# Altium schematic sheet Page06 CPU IO.SchDoc
size 513 x 386 mm; SheetNumber: 6; SheetTotal: 13
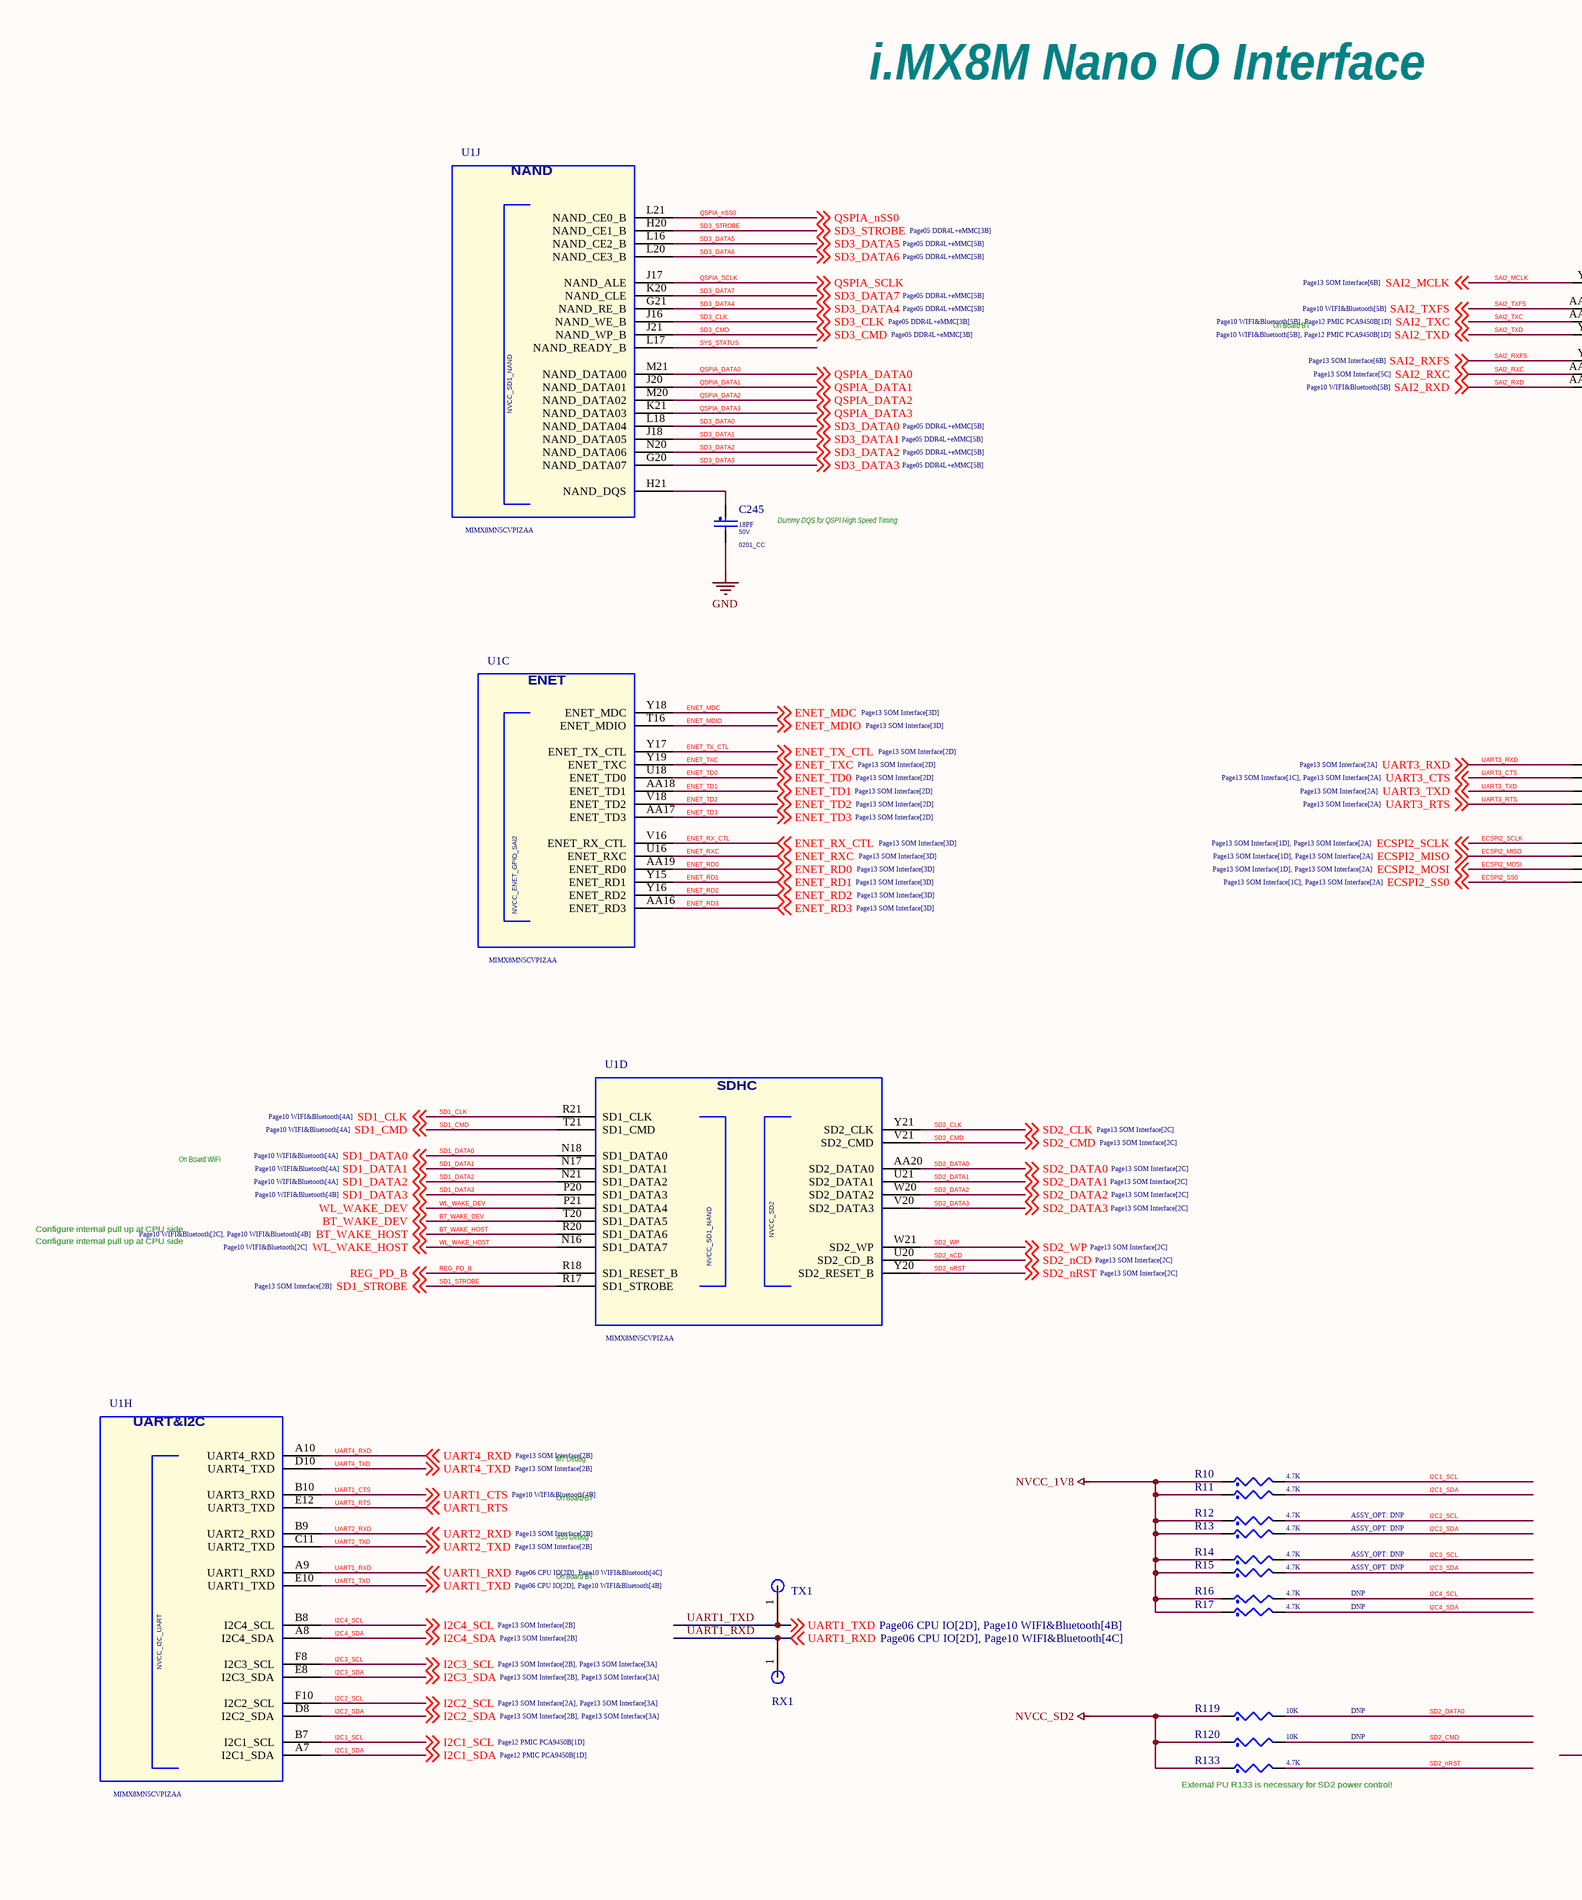
[diagram p0: Page06 CPU IO.SchDoc, left]
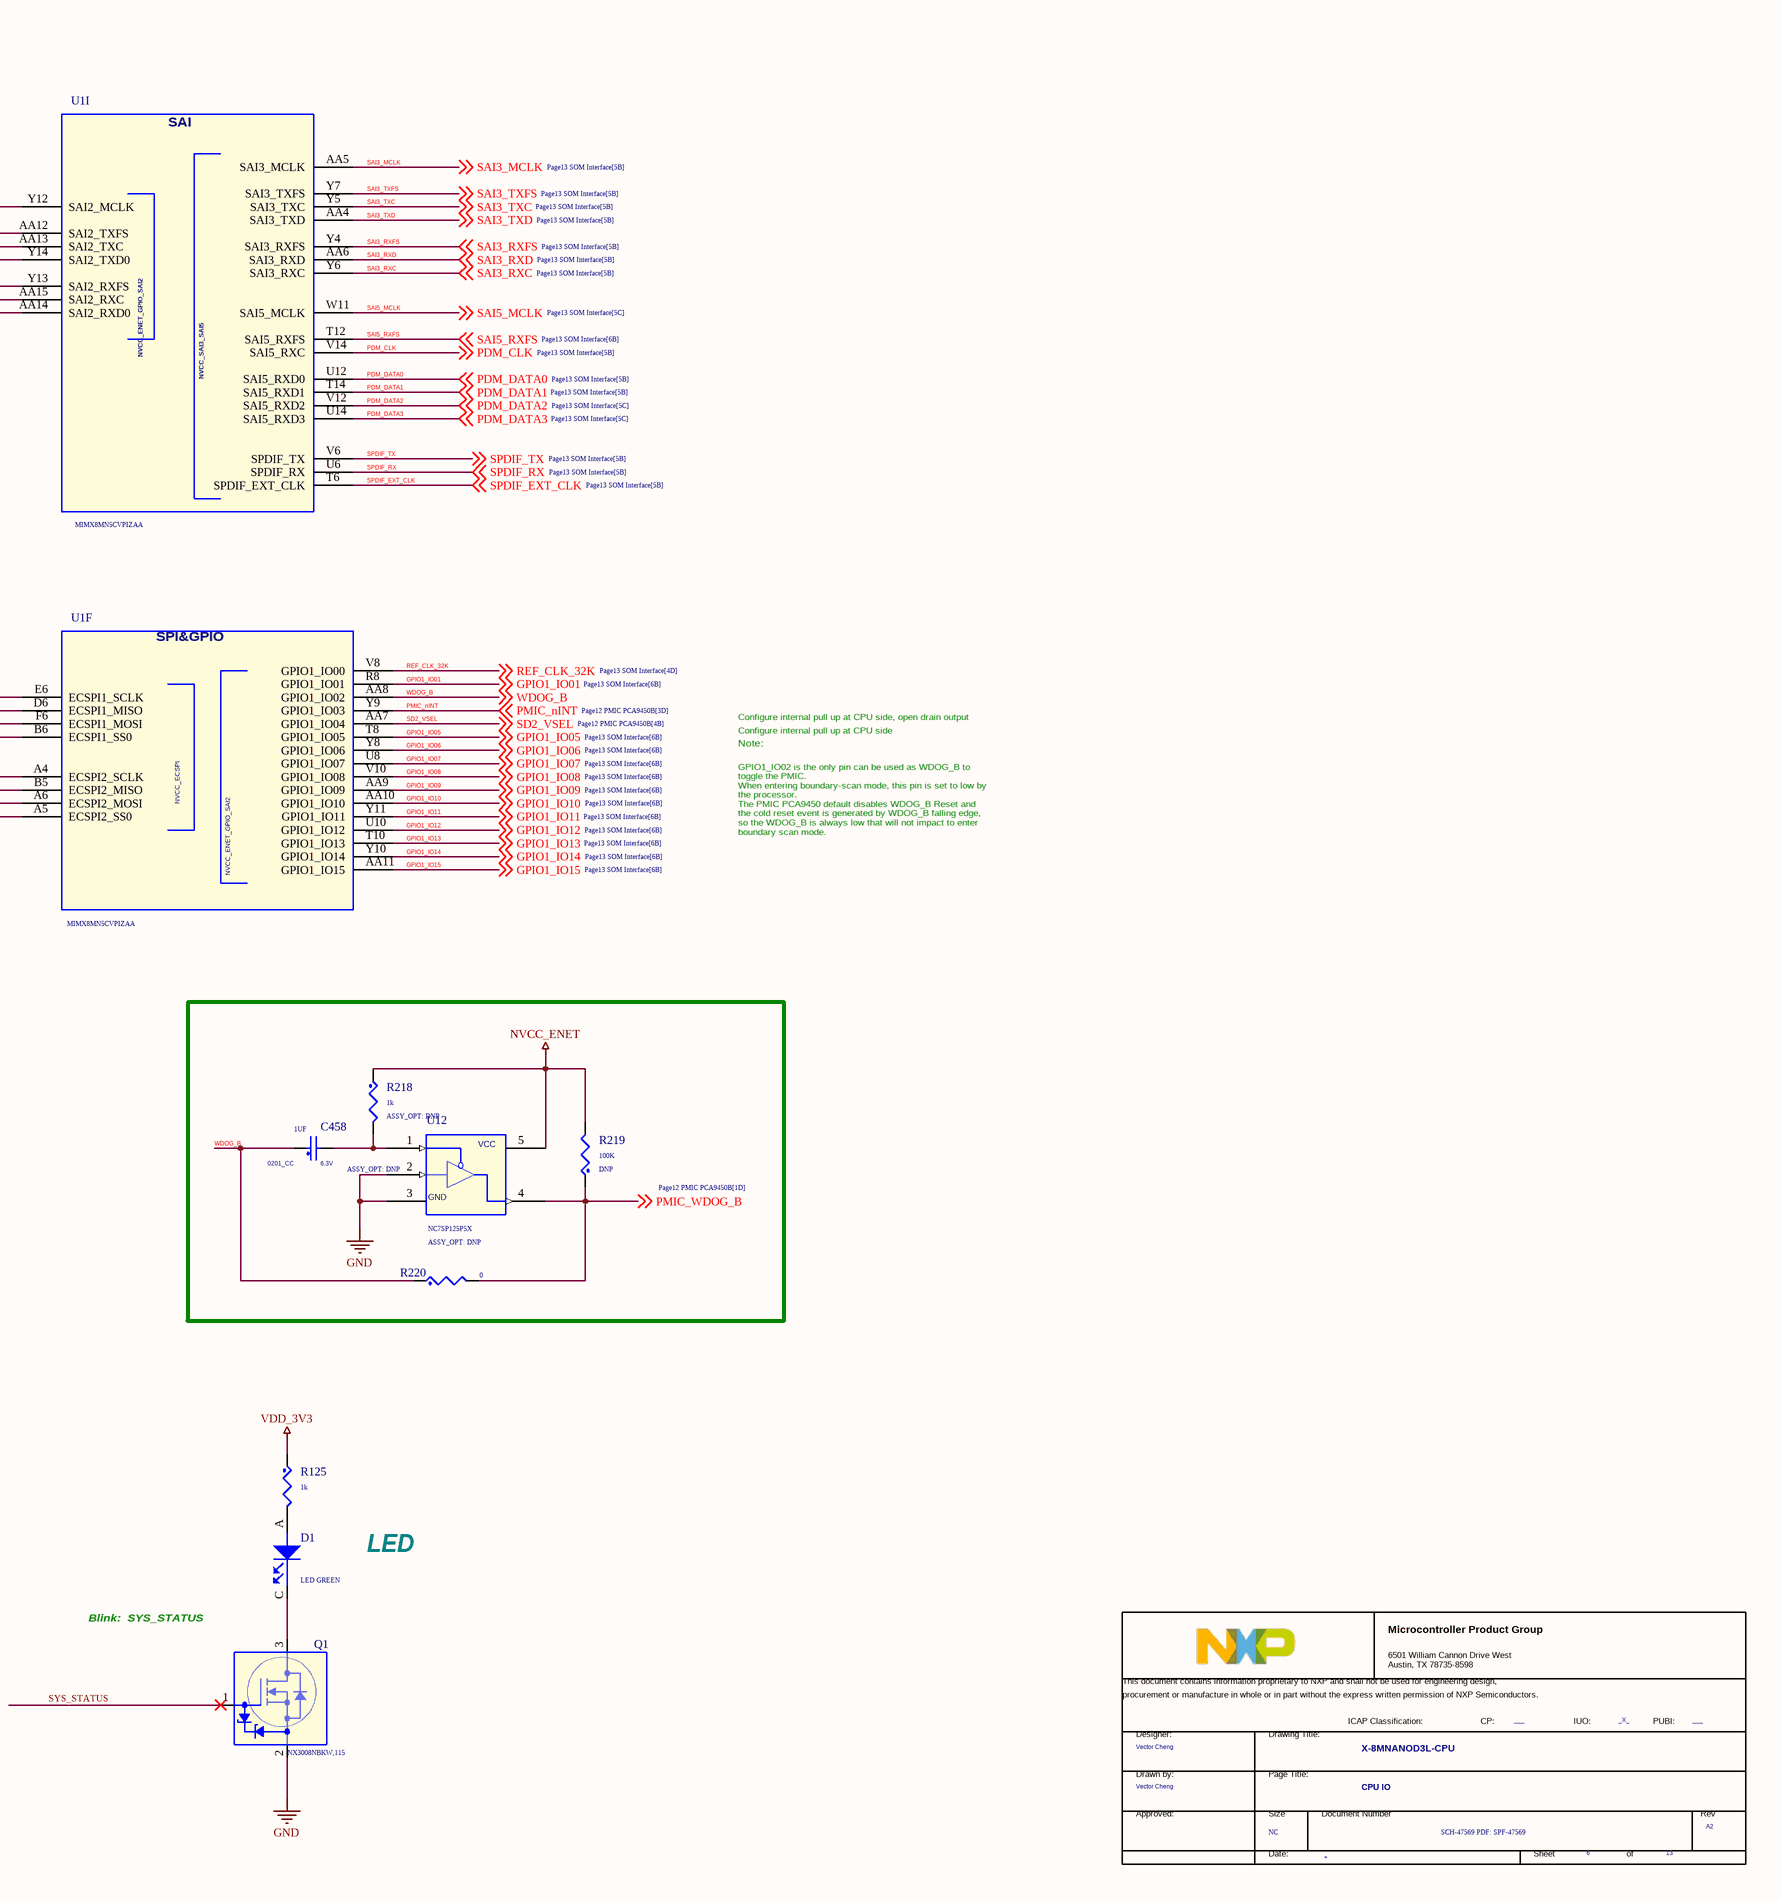
[diagram p1: Page06 CPU IO.SchDoc, right]

## Parts
*  FCP: ___  FIUO: _X_  DrawnBy: Vector Cheng  PageTitle: CPU IO  Page Count: 13  Page Number: 6  Page Size: NC  Title: X-8MNANOD3L-CPU  RevCode: A2  Doc: SCH-47569 PDF: SPF-47569  (hidden comment: TitleBlock_MCPG)  (graphical)
C245  18PF  VOLTAGE: 50V  PCB Footprint: 0201_CC  [0201_CC - C]
C458  1UF  ASSY_OPT: DNP  PCB Footprint: 0201_CC  VOLTAGE: 6.3V  [0201_CC - C]
D1  LED GREEN  [LED_0603]
Q1  NX3008NBKW,115  [SOT65P210X110-3N]
R10  4.7K  [0201_RES]
R11  4.7K  [0201_RES]
R12  4.7K  ASSY_OPT: DNP  [0201_RES]
R13  4.7K  ASSY_OPT: DNP  [0201_RES]
R14  4.7K  ASSY_OPT: DNP  [0201_RES]
R15  4.7K  ASSY_OPT: DNP  [0201_RES]
R16  4.7K  ASSY_OPT: DNP  [0201_RES]
R17  4.7K  ASSY_OPT: DNP  [0201_RES]
R119  10K  ASSY_OPT: DNP  [0201_RES]
R120  10K  ASSY_OPT: DNP  [0201_RES]
R125  1k  [0201_RES]
R133  4.7K  [0201_RES]
R218  1k  ASSY_OPT: DNP  [0201_RES]
R219  100K  ASSY_OPT: DNP  [0201_RES]
R220  0  [0402_CC_RES]
RX1  Test Pin1  [Test Pin]  (value not drawn)
TX1  Test Pin1  [Test Pin]  (value not drawn)
U1  MIMX8MN5CVPIZAA  [BGA306C50P21X21_1100X1100X101]  (parts C,D,F,H,I,J of 12)
U12  NC7SP125P5X  ASSY_OPT: DNP  [FP-MAA05A-IPC_B]

## Nets
GND: C245.2 Q1.2(SOURCE) U12.2(A) U12.3(GND)
NVCC_1V8: R10.1 R11.1 R12.1 R13.1 R14.1 R15.1 R16.1 R17.1
NVCC_ENET: R218.1 R219.2 U12.5(VCC)
NVCC_SD2: R119.1 R120.1 R133.1
VDD_3V3: R125.1
BT_WAKE_DEV: U1.T20(SD1_DATA5) ; off-sheet BT_WAKE_DEV
BT_WAKE_HOST: U1.R20(SD1_DATA6) ; off-sheet BT_WAKE_HOST
ECSPI2_MISO: U1.B5(ECSPI2_MISO) ; off-sheet ECSPI2_MISO
ECSPI2_MOSI: U1.A6(ECSPI2_MOSI) ; off-sheet ECSPI2_MOSI
ECSPI2_SCLK: U1.A4(ECSPI2_SCLK) ; off-sheet ECSPI2_SCLK
ECSPI2_SS0: U1.A5(ECSPI2_SS0) ; off-sheet ECSPI2_SS0
ENET_MDC: U1.Y18(ENET_MDC) ; off-sheet ENET_MDC
ENET_MDIO: U1.T16(ENET_MDIO) ; off-sheet ENET_MDIO
ENET_RD0: U1.AA19(ENET_RD0) ; off-sheet ENET_RD0
ENET_RD1: U1.Y15(ENET_RD1) ; off-sheet ENET_RD1
ENET_RD2: U1.Y16(ENET_RD2) ; off-sheet ENET_RD2
ENET_RD3: U1.AA16(ENET_RD3) ; off-sheet ENET_RD3
ENET_RX_CTL: U1.V16(ENET_RX_CTL) ; off-sheet ENET_RX_CTL
ENET_RXC: U1.U16(ENET_RXC) ; off-sheet ENET_RXC
ENET_TD0: U1.U18(ENET_TD0) ; off-sheet ENET_TD0
ENET_TD1: U1.AA18(ENET_TD1) ; off-sheet ENET_TD1
ENET_TD2: U1.V18(ENET_TD2) ; off-sheet ENET_TD2
ENET_TD3: U1.AA17(ENET_TD3) ; off-sheet ENET_TD3
ENET_TX_CTL: U1.Y17(ENET_TX_CTL) ; off-sheet ENET_TX_CTL
ENET_TXC: U1.Y19(ENET_TXC) ; off-sheet ENET_TXC
GPIO1_IO01: U1.R8(GPIO1_IO01) ; off-sheet GPIO1_IO01
GPIO1_IO05: U1.T8(GPIO1_IO05) ; off-sheet GPIO1_IO05
GPIO1_IO06: U1.Y8(GPIO1_IO06) ; off-sheet GPIO1_IO06
GPIO1_IO07: U1.U8(GPIO1_IO07) ; off-sheet GPIO1_IO07
GPIO1_IO08: U1.V10(GPIO1_IO08) ; off-sheet GPIO1_IO08
GPIO1_IO09: U1.AA9(GPIO1_IO09) ; off-sheet GPIO1_IO09
GPIO1_IO10: U1.AA10(GPIO1_IO10) ; off-sheet GPIO1_IO10
GPIO1_IO11: U1.Y11(GPIO1_IO11) ; off-sheet GPIO1_IO11
GPIO1_IO12: U1.U10(GPIO1_IO12) ; off-sheet GPIO1_IO12
GPIO1_IO13: U1.T10(GPIO1_IO13) ; off-sheet GPIO1_IO13
GPIO1_IO14: U1.Y10(GPIO1_IO14) ; off-sheet GPIO1_IO14
GPIO1_IO15: U1.AA11(GPIO1_IO15) ; off-sheet GPIO1_IO15
I2C1_SCL: R10.2 U1.B7(I2C1_SCL) ; off-sheet I2C1_SCL
I2C1_SDA: R11.2 U1.A7(I2C1_SDA) ; off-sheet I2C1_SDA
I2C2_SCL: R12.2 U1.F10(I2C2_SCL) ; off-sheet I2C2_SCL
I2C2_SDA: R13.2 U1.D8(I2C2_SDA) ; off-sheet I2C2_SDA
I2C3_SCL: R14.2 U1.F8(I2C3_SCL) ; off-sheet I2C3_SCL
I2C3_SDA: R15.2 U1.E8(I2C3_SDA) ; off-sheet I2C3_SDA
I2C4_SCL: R16.2 U1.B8(I2C4_SCL) ; off-sheet I2C4_SCL
I2C4_SDA: R17.2 U1.A8(I2C4_SDA) ; off-sheet I2C4_SDA
PDM_CLK: U1.V14(SAI5_RXC) ; off-sheet PDM_CLK
PDM_DATA0: U1.U12(SAI5_RXD0) ; off-sheet PDM_DATA0
PDM_DATA1: U1.T14(SAI5_RXD1) ; off-sheet PDM_DATA1
PDM_DATA2: U1.V12(SAI5_RXD2) ; off-sheet PDM_DATA2
PDM_DATA3: U1.U14(SAI5_RXD3) ; off-sheet PDM_DATA3
PMIC_nINT: U1.Y9(GPIO1_IO03) ; off-sheet PMIC_nINT
PMIC_WDOG_B: R219.1 R220.2 U12.4(Y) ; off-sheet PMIC_WDOG_B
QSPIA_DATA0: U1.M21(NAND_DATA00) ; off-sheet QSPIA_DATA0
QSPIA_DATA1: U1.J20(NAND_DATA01) ; off-sheet QSPIA_DATA1
QSPIA_DATA2: U1.M20(NAND_DATA02) ; off-sheet QSPIA_DATA2
QSPIA_DATA3: U1.K21(NAND_DATA03) ; off-sheet QSPIA_DATA3
QSPIA_nSS0: U1.L21(NAND_CE0_B) ; off-sheet QSPIA_nSS0
QSPIA_SCLK: U1.J17(NAND_ALE) ; off-sheet QSPIA_SCLK
REF_CLK_32K: U1.V8(GPIO1_IO00) ; off-sheet REF_CLK_32K
REG_PD_B: U1.R18(SD1_RESET_B) ; off-sheet REG_PD_B
SAI2_MCLK: U1.Y12(SAI2_MCLK) ; off-sheet SAI2_MCLK
SAI2_RXC: U1.AA15(SAI2_RXC) ; off-sheet SAI2_RXC
SAI2_RXD: U1.AA14(SAI2_RXD0) ; off-sheet SAI2_RXD
SAI2_RXFS: U1.Y13(SAI2_RXFS) ; off-sheet SAI2_RXFS
SAI2_TXC: U1.AA13(SAI2_TXC) ; off-sheet SAI2_TXC
SAI2_TXD: U1.Y14(SAI2_TXD0) ; off-sheet SAI2_TXD
SAI2_TXFS: U1.AA12(SAI2_TXFS) ; off-sheet SAI2_TXFS
SAI3_MCLK: U1.AA5(SAI3_MCLK) ; off-sheet SAI3_MCLK
SAI3_RXC: U1.Y6(SAI3_RXC) ; off-sheet SAI3_RXC
SAI3_RXD: U1.AA6(SAI3_RXD) ; off-sheet SAI3_RXD
SAI3_RXFS: U1.Y4(SAI3_RXFS) ; off-sheet SAI3_RXFS
SAI3_TXC: U1.Y5(SAI3_TXC) ; off-sheet SAI3_TXC
SAI3_TXD: U1.AA4(SAI3_TXD) ; off-sheet SAI3_TXD
SAI3_TXFS: U1.Y7(SAI3_TXFS) ; off-sheet SAI3_TXFS
SAI5_MCLK: U1.W11(SAI5_MCLK) ; off-sheet SAI5_MCLK
SAI5_RXFS: U1.T12(SAI5_RXFS) ; off-sheet SAI5_RXFS
SD1_CLK: U1.R21(SD1_CLK) ; off-sheet SD1_CLK
SD1_CMD: U1.T21(SD1_CMD) ; off-sheet SD1_CMD
SD1_DATA0: U1.N18(SD1_DATA0) ; off-sheet SD1_DATA0
SD1_DATA1: U1.N17(SD1_DATA1) ; off-sheet SD1_DATA1
SD1_DATA2: U1.N21(SD1_DATA2) ; off-sheet SD1_DATA2
SD1_DATA3: U1.P20(SD1_DATA3) ; off-sheet SD1_DATA3
SD1_STROBE: U1.R17(SD1_STROBE) ; off-sheet SD1_STROBE
SD2_CLK: U1.Y21(SD2_CLK) ; off-sheet SD2_CLK
SD2_CMD: R120.2 U1.V21(SD2_CMD) ; off-sheet SD2_CMD
SD2_DATA0: R119.2 U1.AA20(SD2_DATA0) ; off-sheet SD2_DATA0
SD2_DATA1: U1.U21(SD2_DATA1) ; off-sheet SD2_DATA1
SD2_DATA2: U1.W20(SD2_DATA2) ; off-sheet SD2_DATA2
SD2_DATA3: U1.V20(SD2_DATA3) ; off-sheet SD2_DATA3
SD2_nCD: U1.U20(SD2_CD_B) ; off-sheet SD2_nCD
SD2_nRST: R133.2 U1.Y20(SD2_RESET_B) ; off-sheet SD2_nRST
SD2_VSEL: U1.AA7(GPIO1_IO04) ; off-sheet SD2_VSEL
SD2_WP: U1.W21(SD2_WP) ; off-sheet SD2_WP
SD3_CLK: U1.J16(NAND_WE_B) ; off-sheet SD3_CLK
SD3_CMD: U1.J21(NAND_WP_B) ; off-sheet SD3_CMD
SD3_DATA0: U1.L18(NAND_DATA04) ; off-sheet SD3_DATA0
SD3_DATA1: U1.J18(NAND_DATA05) ; off-sheet SD3_DATA1
SD3_DATA2: U1.N20(NAND_DATA06) ; off-sheet SD3_DATA2
SD3_DATA3: U1.G20(NAND_DATA07) ; off-sheet SD3_DATA3
SD3_DATA4: U1.G21(NAND_RE_B) ; off-sheet SD3_DATA4
SD3_DATA5: U1.L16(NAND_CE2_B) ; off-sheet SD3_DATA5
SD3_DATA6: U1.L20(NAND_CE3_B) ; off-sheet SD3_DATA6
SD3_DATA7: U1.K20(NAND_CLE) ; off-sheet SD3_DATA7
SD3_STROBE: U1.H20(NAND_CE1_B) ; off-sheet SD3_STROBE
SPDIF_EXT_CLK: U1.T6(SPDIF_EXT_CLK) ; off-sheet SPDIF_EXT_CLK
SPDIF_RX: U1.U6(SPDIF_RX) ; off-sheet SPDIF_RX
SPDIF_TX: U1.V6(SPDIF_TX) ; off-sheet SPDIF_TX
SYS_STATUS: Q1.1(GATE) U1.L17(NAND_READY_B)
UART1_CTS: U1.B10(UART3_RXD) ; off-sheet UART1_CTS
UART1_RTS: U1.E12(UART3_TXD) ; off-sheet UART1_RTS
UART1_RXD: RX1.1 U1.A9(UART1_RXD) ; off-sheet UART1_RXD
UART1_TXD: TX1.1 U1.E10(UART1_TXD) ; off-sheet UART1_TXD
UART2_RXD: U1.B9(UART2_RXD) ; off-sheet UART2_RXD
UART2_TXD: U1.C11(UART2_TXD) ; off-sheet UART2_TXD
UART3_CTS: U1.D6(ECSPI1_MISO) ; off-sheet UART3_CTS
UART3_RTS: U1.B6(ECSPI1_SS0) ; off-sheet UART3_RTS
UART3_RXD: U1.E6(ECSPI1_SCLK) ; off-sheet UART3_RXD
UART3_TXD: U1.F6(ECSPI1_MOSI) ; off-sheet UART3_TXD
UART4_RXD: U1.A10(UART4_RXD) ; off-sheet UART4_RXD
UART4_TXD: U1.D10(UART4_TXD) ; off-sheet UART4_TXD
WDOG_B: C458.1 R220.1 U1.AA8(GPIO1_IO02) ; off-sheet WDOG_B
WL_WAKE_DEV: U1.P21(SD1_DATA4) ; off-sheet WL_WAKE_DEV
WL_WAKE_HOST: U1.N16(SD1_DATA7) ; off-sheet WL_WAKE_HOST
NetC245_1: C245.1 U1.H21(NAND_DQS)
NetC458_2: C458.2 R218.2 U12.1(~{OE})
NetD1_A: D1.A(ANODE) R125.2
NetD1_C: D1.C(CATHODE) Q1.3(DRAIN)

## Notes on the sheet
- i.MX8M Nano IO Interface
- On Board BT
- Dummy DQS for QSPI High Speed Timing
- Configure internal pull up at CPU side, open drain output
- Configure internal pull up at CPU side
- Note:
- GPIO1_IO02 is the only pin can be used as WDOG_B to
  toggle the PMIC.
  When entering boundary-scan mode, this pin is set to low by
  the processor.
  The PMIC PCA9450 default disables WDOG_B Reset and
  the cold reset event is generated by WDOG_B falling edge,
  so the WDOG_B is always low that will not impact to enter
  boundary scan mode.
- On Board WiFi
- M7 Debug
- A53 Debug
- LED
- Blink:  SYS_STATUS
- (near R133) External PU R133 is necessary for SD2 power control!
- (in symbol MIMX8MN, part C) ENET
- (in symbol MIMX8MN, part D) SDHC
- (in symbol MIMX8MN, part F) SPI&GPIO
- (in symbol MIMX8MN, part H) UART&I2C
- (in symbol MIMX8MN, part I) SAI
- (in symbol MIMX8MN, part J) NAND
- (in symbol TitleBlock_MCPG) Microcontroller Product Group; 6501 William Cannon Drive West / Austin, TX 78735-8598; This document contains information proprietary to NXP and shall not be used for engineering design,; procurement or manufacture in whole or in part without the express written permission of NXP Semiconductors.; ICAP Classification:; CP:; IUO:; PUBI:; Designer:; Drawing Title:; Drawn by:; Page Title:; Approved:; Size; Document Number; Rev; Date:; Sheet; of

## Library data of the parts
* = TitleBlock_MCPG: OrgAddr1: NO. 192 Liangjing Rd. Pudong New Area, ShangHai; OrgName: NXP Semiconductor; PUBI: ___; Designer: Vector Cheng; Page Create Date: March  8, 1995; Page Modify Date: *
C245 = CAP_NP: CAP CER 18pF 50V 5% C0G 0201; CLASS: DISCRETE; FPLIST: CC0201,CC0201_HD,0201_CC; CAD_APPROVED: Yes; MFG_PN01: GRM0335C1H180JA01D; MFG_NAME01: MURATA; AGILE_PN: 150-79476; Package Type: &#966;180mm Paper taping; Package Size: 0201; HEIGHT: 0.33MM; ROHS: Yes; Tolerance: 5%
C458 = CAP_NP: CAP CER 1uF 6.3V 20% X5R 0201; CLASS: DISCRETE; AGILE_PN: 150-79407; MFG_NAME01: AVX; MFG_PN01: 02016D105MAT2A; CAD_APPROVED: Yes; FPLIST: CC0201,CC0201_HD,0201_CC,0201_CC_012SM_NSP; Tolerance: 20%; ROHS: Yes; HEIGHT: 0.35MM; Package Size: 0201; Package Type: 7¡± reel
D1 = LED: LED GRN SGL 25MA SMT 0603; CLASS: IC; VOLTAGE: 2V; AGILE_PN: 370-76672; MFG_NAME01: DIALIGHT; MFG_PN01: 598-8070-107F; CAD_APPROVED: Yes; ROHS: Yes; HEIGHT: 0.8 MM; PCB Footprint: LED_0603
Q1 = NMOS_NX3008NBK: TRAN NMOS SW 30V 350mA AEC-Q101 SC-70; CLASS: IC; CAD_APPROVED: Yes; MFG_NAME01: NEXPERIA; AGILE_PN: 480-79736; PCB Footprint: sc70_3; HEIGHT: 1.1MM; ROHS: Yes; MFG_PN01: NX3008NBKW,115
R10 R11 R14-R17 R133 = RES: RES MF 4.7K 1/20W 5% AEC-Q200 0201; CLASS: DISCRETE; Temp Range: -55C to +155C; AGILE_PN: 470-79700; MFG_NAME01: KOA SPEER; MFG_PN01: RK73B1HTTC472J; CAD_APPROVED: Yes; FPLIST: RC0201,0201_CC; PCB Footprint: 0201_CC; Tolerance: 5%; ROHS: Yes; Temp_Range: -55C to +155C; HEIGHT: 0.25MM
R12 R13 = RES: RES MF 4.7K 1/20W 5% AEC-Q200 0201; CLASS: DISCRETE; Temp Range: -55C to +155C; FPLIST: RC0201,0201_CC; CAD_APPROVED: Yes; MFG_PN01: RK73B1HTTC472J; MFG_NAME01: KOA SPEER; AGILE_PN: 470-79700; PCB Footprint: 0201_CC; HEIGHT: 0.25MM; Temp_Range: -55C to +155C; ROHS: Yes; Tolerance: 5%
R119 = RES: RES MF 10K 1/20W 5% 0201; CLASS: DISCRETE; FPLIST: RC0201,0201_CC; CAD_APPROVED: Yes; MFG_PN01: RTT01103JTH; MFG_NAME01: RALEC ELECTRONIC CORP; AGILE_PN: 470-79719; PCB Footprint: 0201_CC; HEIGHT: 0.26 MM; ROHS: Yes; Tolerance: 5%
R120 = RES: RES MF 10K 1/20W 5% 0201; CLASS: DISCRETE; AGILE_PN: 470-79719; MFG_NAME01: RALEC ELECTRONIC CORP; MFG_PN01: RTT01103JTH; CAD_APPROVED: Yes; FPLIST: RC0201,0201_CC; PCB Footprint: 0201_CC; Tolerance: 5%; ROHS: Yes; HEIGHT: 0.26 MM
R125 = RES: RES MF 1.0K OHM 1/20W 1% 30V -55+155C 0201; CLASS: DISCRETE; Temp Range: -55¡ãC ~ 155¡ãC; VOLTAGE: 30; FPLIST: RC0201,0201_CC; CAD_APPROVED: Yes; MFG_PN01: CRCW02011K00FNED; MFG_NAME01: VISHAY INTERTECHNOLOGY; AGILE_PN: 470-82221; PCB Footprint: 0201_CC; HEIGHT: 0.28MM; Temp_Range: -55¡ãC ~ 155¡ãC; ROHS: Yes; Tolerance: 1%
R218 = RES: RES MF 1.0K OHM 1/20W 1% 30V -55+155C 0201; CLASS: DISCRETE; PCB Footprint: 0201_CC; AGILE_PN: 470-82221; MFG_NAME01: VISHAY INTERTECHNOLOGY; MFG_PN01: CRCW02011K00FNED; Temp_Range: -55¡ãC ~ 155¡ãC; CAD_APPROVED: Yes; FPLIST: RC0201,0201_CC; VOLTAGE: 30; Tolerance: 1%; ROHS: Yes; HEIGHT: 0.28MM; Temp Range: -55¡ãC ~ 155¡ãC
R219 = RES: RES MF 100K 1/20W 1% 0201; CLASS: DISCRETE; PCB Footprint: 0201_CC; AGILE_PN: 470-77704; MFG_NAME01: SKYMOS; MFG_PN01: RC-0201-104FT; CAD_APPROVED: Yes; FPLIST: RC0201,0201_CC; Tolerance: 1%; ROHS: Yes; HEIGHT: 0.26MM
R220 = RES: RES MF ZERO OHM 1/16W 5% 0402; CLASS: DISCRETE; PCB Footprint: 0402_CC; FPLIST: RC0402_25,RC0402_HD,RC0402_X2,0402_CC; CAD_APPROVED: Yes; MFG_PN01: RC0402JR-070RL; MFG_NAME01: YAGEO AMERICA; AGILE_PN: 470-75394; HEIGHT: 0.45 MM; ROHS: Yes; Tolerance: 5%; VOLTAGE: 1/16W
U1 = MIMX8MN: IC CPU QUAD CORTEX A53+M7 1.4GHZ -- BGA306; PCB Footprint: pbga306_0p5_sq11mm; AGILE_PN: TMP-CIP-5098; CAD_APPROVED: Yes; PRE_APN: 330-77152; Temp Range: -40¡ãC to 105¡ãC; MFG_NAME01: NXP SEMICONDUCTORS; CLASS: IC; HEIGHT: 1.01MM; ROHS: Yes; MFG_PN01: MIMX8MN5CVPIZAA
U12 = 1G125: IC BUF TS 0.9-3.6V; PCB Footprint: SC70-5_A; MFG_NAME01: FAIRCHILD; CAD_APPROVED: Yes; AGILE_PN: 312-30153; CLASS: IC; MFG_PN01: NC7SP125P5X; ROHS: Yes; HEIGHT: 1.1MM